# Altium schematic sheet 01-POWER.SchDoc
size A4; SheetNumber: 1; SheetTotal: 3
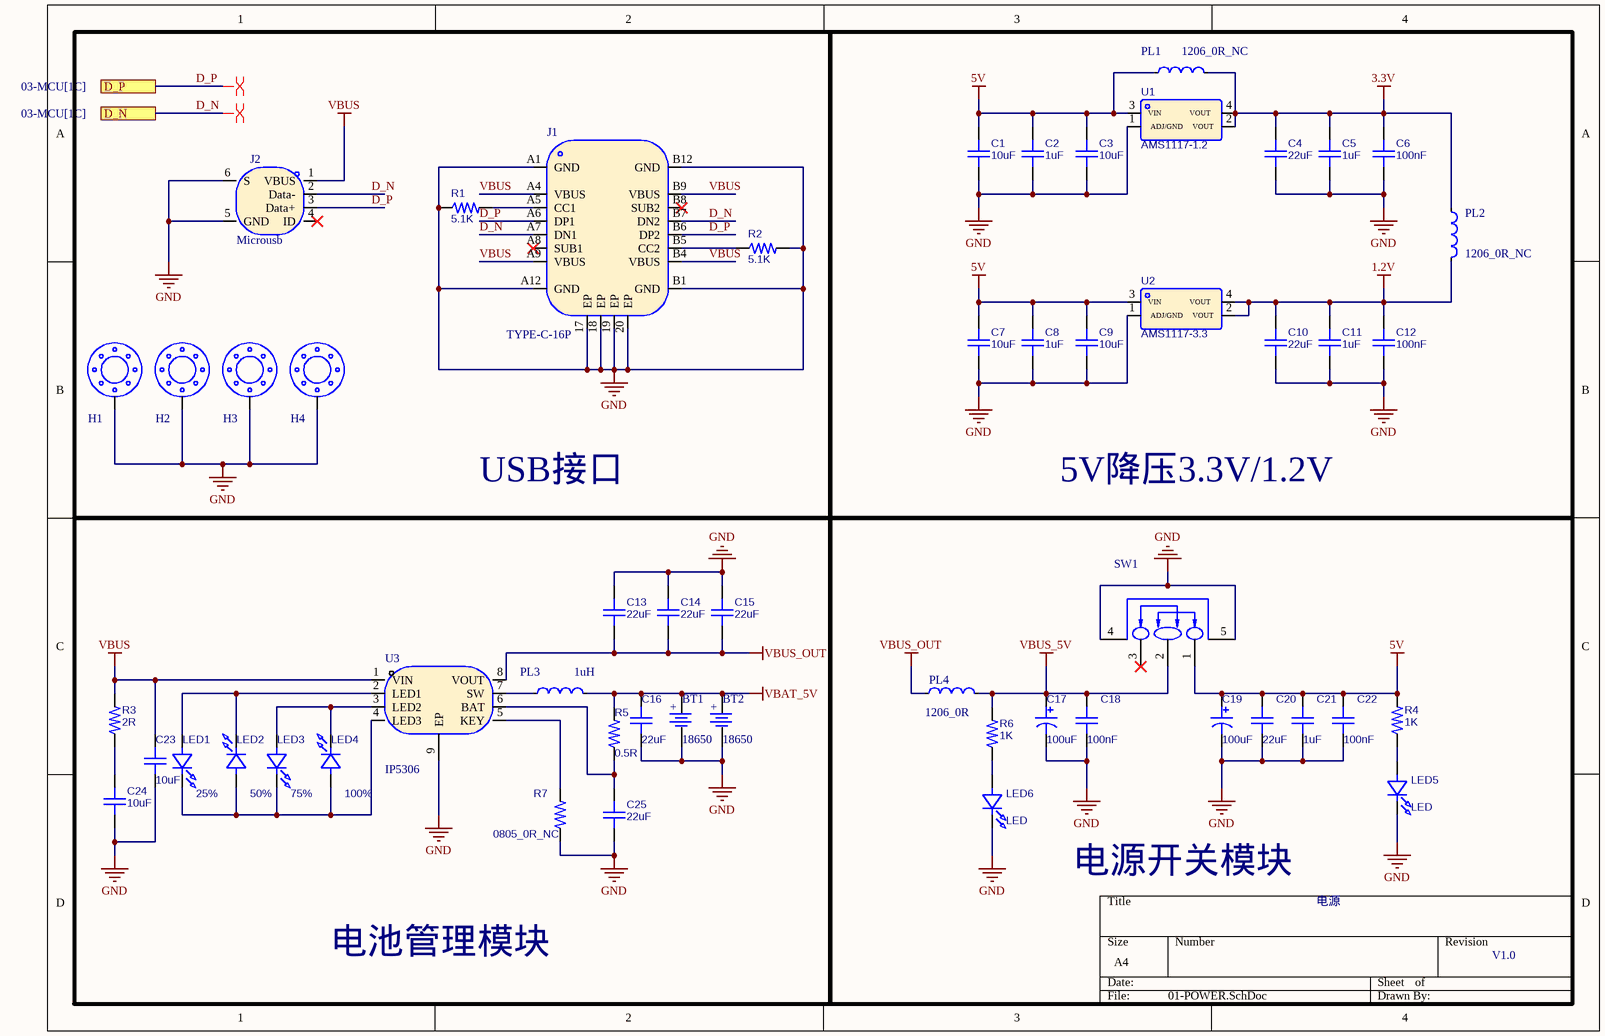
[diagram p0: 01-POWER.SchDoc]

## Parts
BT1  18650  [BAT-SMD-18650]
BT2  18650  [BAT-SMD-18650]
C1  10uF  [CAP-SMD-0603]
C2  1uF  [CAP-SMD-0603]
C3  10uF  [CAP-SMD-0603]
C4  22uF  [CAP-SMD-0603]
C5  1uF  [CAP-SMD-0603]
C6  100nF  [CAP-SMD-0603]
C7  10uF  [CAP-SMD-0603]
C8  1uF  [CAP-SMD-0603]
C9  10uF  [CAP-SMD-0603]
C10  22uF  [CAP-SMD-0603]
C11  1uF  [CAP-SMD-0603]
C12  100nF  [CAP-SMD-0603]
C13  22uF  [CAP-SMD-0603]
C14  22uF  [CAP-SMD-0603]
C15  22uF  [CAP-SMD-0603]
C16  22uF  [CAP-SMD-0603]
C17  100uF  [CAPA-TH-5020-P2.0]
C18  100nF  [CAP-SMD-0603]
C19  100uF  [CAPA-TH-5020-P2.0]
C20  22uF  [CAP-SMD-0603]
C21  1uF  [CAP-SMD-0603]
C22  100nF  [CAP-SMD-0603]
C23  10uF  [CAP-SMD-0603]
C24  10uF  [CAP-SMD-0603]
C25  22uF  [CAP-SMD-0603]
H1  M3  [M3-5030-0.3]  (value not drawn)
H2  M3  [M3-5030-0.3]  (value not drawn)
H3  M3  [M3-5030-0.3]  (value not drawn)
H4  M3  [M3-5030-0.3]  (value not drawn)
J1  TYPE-C-16P  [TYPE-C-SMD-16P]
J2  Microusb  [Microusb-SMD-5P]
LED1  25%  [LED-SMD-0805]
LED2  50%  [LED-SMD-0805]
LED3  75%  [LED-SMD-0805]
LED4  100%  [LED-SMD-0805]
LED5  LED  [LED-SMD-0805]
LED6  LED  [LED-SMD-0805]
PL1  1206_0R_NC  [PL-SMD_4.4X4.2-P3.7]
PL2  1206_0R_NC  [PL-SMD_4.4X4.2-P3.7]
PL3  1uH  [PL-SMD_4.4X4.2-P3.7]
PL4  1206_0R  [PL-SMD_4.4X4.2-P3.7]
R1  5.1K  [RES-SMD-0603]
R2  5.1K  [RES-SMD-0603]
R3  2R  [RES-SMD-0603]
R4  1K  [RES-SMD-0603]
R5  0.5R  [RES-SMD-0603]
R6  1K  [RES-SMD-0603]
R7  0805_0R_NC  [RES-SMD-0603]
SW1  SS-12D11G5  [SW-TH-D-P4.8]  (value not drawn)
U1  AMS1117-1.2  [SOT-223-4-LP5.7-P2.3]
U2  AMS1117-3.3  [SOT-223-4-LP5.7-P2.3]
U3  IP5306  [ESOP-8-LP5.3-P1.27]

## Blocks framed on the sheet
USB接口: H1-H4 J1 J2 R1 R2
5V降压3.3V/1.2V: C1-C12 PL1 PL2 U1 U2
电池管理模块: BT1 BT2 C13-C16 C23-C25 LED1-LED4 PL3 R3 R5 R7 U3
电源开关模块: C17-C22 LED5 LED6 PL4 R4 R6 SW1

## Ports
D_N (see 03-MCU[1C]), D_P (see 03-MCU[1C])

## Nets
1.2V: C10.2 C11.2 C12.2 PL2.2 U2.2(VOUT) U2.4(VOUT)
3.3V: C4.2 C5.2 C6.2 PL1.2 PL2.1 U1.2(VOUT) U1.4(VOUT)
5V: C1.2 C2.2 C3.2 C7.2 C8.2 C9.2 C19.1 C20.2 C21.2 C22.2 PL1.1 R4.2 SW1.1 U1.3(VIN) U2.3(VIN)
GND: BT1.2(+) BT2.2(+) C1.1 C2.1 C3.1 C4.1 C5.1 C6.1 C7.1 C8.1 C9.1 C10.1 C11.1 C12.1 C13.2 C14.2 C15.2 C16.1 C17.2 C18.1 C19.2 C20.1 C21.1 C22.1 C23.1 C24.1 C25.1 H1.1 H2.1 H3.1 H4.1 J1.17(EP) J1.18(EP) J1.19(EP) J1.20(EP) J1.A1(GND) J1.A12(GND) J1.B1(GND) J1.B12(GND) J2.5(GND) J2.6(S) LED5.2(K) LED6.2(K) R1.1 R2.2 R7.1 SW1.4 SW1.5 U1.1(ADJ/GND) U2.1(ADJ/GND) U3.9(EP)
VBAT_5V: BT1.1(-) BT2.1(-) C16.2 PL3.2 R5.2
VBUS: C23.2 J1.A4(VBUS) J1.A9(VBUS) J1.B4(VBUS) J1.B9(VBUS) J2.1(VBUS) R3.2 U3.1(VIN)
VBUS_5V: C17.1 C18.2 PL4.2 R6.2 SW1.2
VBUS_OUT: C13.1 C14.1 C15.1 PL4.1 U3.8(VOUT)
D_N: J1.A7(DN1) J1.B7(DN2) J2.2(Data-) ; port D_N
D_P: J1.A6(DP1) J1.B6(DP2) J2.3(Data+) ; port D_P
NetC24_2: C24.2 R3.1
NetC25_2: C25.2 R5.1 U3.6(BAT)
NetJ1_A5: J1.A5(CC1) R1.2
NetJ1_B5: J1.B5(CC2) R2.1
NetLED1_1: LED1.1(A) LED2.2(K) U3.2(LED1)
NetLED1_2: LED1.2(K) LED2.1(A) LED3.2(K) LED4.1(A) U3.4(LED3)
NetLED3_1: LED3.1(A) LED4.2(K) U3.3(LED2)
NetLED5_1: LED5.1(A) R4.1
NetLED6_1: LED6.1(A) R6.1
NetPL3_1: PL3.1 U3.7(SW)
NetR7_2: R7.2 U3.5(KEY)

Not connected (* = marked no-connect by the designer): J1 A8(SUB1)* B8(SUB2)*; J2 4(ID)*; SW1 3*

## Layout directives
differential pair: D_N, D_P

## Notes on the sheet
- 电源
- V1.0

## Library data of the parts
BT1 BT2 = CR2032: 纽扣电池CR2032-BS-6-1; Manufacturer: Q&J; Add into BOM: yes; Connector Type: 电池底座; Symbol: CR2032-BS-6-1; Device: CR2032-BS-6-1; LCSC Part Name: 电池底座 适用电池:CR2032; Supplier Part: C70377; Manufacturer Part: CR2032-BS-6-1; Supplier Footprint: SMD; JLCPCB Part Class: Extended Part; Datasheet: https://atta.szlcsc.com/upload/public/pdf/source/20160427/1461725216549.pdf; Supplier: LCSC; Convert to PCB: yes; Battery Type: CR2032; Operating Temperature Range: -
C1-C16 C18 C20-C25 = CAP: 贴片电容; BOM_Manufacturer: SAMSUNG; BOM_Manufacturer Part: CL03A104KQ3NNNC; nameAlias: Capacitance; Contributor: LCSC; BOM_Supplier: LCSC; BOM_Supplier Part: C160831; BOM_JLCPCB Part Class: Extended Part; spicePre: C; spiceSymbolName: CL03A104KQ3NNNC
C17 C19 = CAPA: 电解电容; BOM_Manufacturer: ValuePro; BOM_Manufacturer Part: 普通黑色470UF 50V; nameAlias: Capacitance; BOM_Supplier: LCSC; BOM_Supplier Part: C34642; BOM_JLCPCB Part Class: Extended Part; spicePre: C; spiceSymbolName: 470UF 50V
H1-H4 = M3: M3螺丝孔
J1 = TYPE-C-16P: TYPE-C-16pin; Manufacturer: kinghelm(金航标); Symbol: KH-TYPE-C-16P; Add into BOM: yes; Connector Type: Type-C; Gender: 母座; Number of Contacts: 16; Number of Ports: 1; Current Rating - Power (Max): 3A; Device: KH-TYPE-C-16P; LCSC Part Name: Type-C 母座 卧贴; Supplier Part: C709357; Manufacturer Part: KH-TYPE-C-16P; Supplier Footprint: SMD; JLCPCB Part Class: Extended Part; Datasheet: https://atta.szlcsc.com/upload/public/pdf/source/20200911/C709357_AA8DCEB38BB20E3035A7ED7AE7667837.pdf; Supplier: LCSC; Convert to PCB: yes; Standard: -; Mounting Style: 卧贴; Operating Temperature Range: -40~+85
J2 = Microusb-5P: 安卓阶梯型USB接口; Manufacturer: Amphenol; Symbol: 10118194-0001LF; Add into BOM: yes; Connector Type: Micro-B; Gender: 母座; Number of Contacts: 5; Number of Ports: 1; Device: 10118194-0001LF; LCSC Part Name: Micro-B 母座; Supplier Part: C132563; Manufacturer Part: 10118194-0001LF; Supplier Footprint: SMD; JLCPCB Part Class: Extended Part; Datasheet: https://atta.szlcsc.com/upload/public/pdf/source/20210630/C132563_323781699BE9D7BFAD8DF70EA5820798.pdf; Supplier: LCSC; Convert to PCB: yes; Standard: USB 2.0
LED1-LED6 = LED: LED灯,发光二极管; BOM_Manufacturer: yongyu(永裕光电); BOM_Manufacturer Part: SZYY0402B; Contributor: LCSC; BOM_Supplier: LCSC; BOM_Supplier Part: C434447; spicePre: L; spiceSymbolName: SZYY0402B
PL1-PL4 = PL-IND: 电感; Manufacturer: Sunlord(顺络); Symbol: GZ1608D121TF-C12391; Device: GZ1608D121TF; Add into BOM: yes; Impedance @ Frequency: 120Ω@100MHz; Tolerance: ±25%; DC Resistance: 200mΩ; Current Rating: 300mA; Circuits: 1; LCSC Part Name: 120Ω@100MHz ±25%; Supplier Part: C12391; Manufacturer Part: GZ1608D121TF; Supplier Footprint: 0603; JLCPCB Part Class: Extended Part; Datasheet: https://atta.szlcsc.com/upload/public/pdf/source/20210830/355EA7C0FAC5394FC0FE3F17C770C20A.pdf; Supplier: LCSC; Convert to PCB: yes
R1-R7 = RES: 贴片电阻; BOM_Manufacturer: Chengdu Guosheng Tech; BOM_Manufacturer Part: 3362P-1-104; Resistance(Ohms): 100K; nameAlias: Resistance; Contributor: LCSC; BOM_Supplier: LCSC; BOM_Supplier Part: C118966; Resistance (Ohms): 100K; BOM_JLCPCB Part Class: Extended Part; spicePre: R; spiceSymbolName: 3362P-1-104_C118966
SW1 = SW-D-3P: 额定电流(DC)：3A 额定电压(DC)：125V 额定电流(AC)：3A 额定电压(AC)：125V; Manufacturer: XKB Connectivity(中国星坤); Add into BOM: yes; Current Rating (DC): 3A; Voltage Rating (DC): 125V; Circuit: 单刀双掷; Mechanical Life: 10000; Actuator Color: 黑色; Actuator Style: 矩形柱状; Pin Style: PC引脚; Switch Length: 13.5mm; Switch Width: 6.6mm; Switch Height: 6.3mm; Name: SS-12D11G5; Symbol: SS-12D11G5; Device: SS-12D11G5; LCSC Part Name: SS-12D11G5; Supplier Part: C692484; Manufacturer Part: SS-12D11G5; Supplier Footprint: 插件; JLCPCB Part Class: 扩展库; Datasheet: https://atta.szlcsc.com/upload/public/pdf/source/20211009/84F89DEF741E27E9E55DE4039DC07CAD.pdf; Supplier: LCSC; Convert to PCB: yes; Current Rating (AC): 3A; Voltage Rating (AC): 125V; Mounting Style: 弯插; Operating Temperature: -40~+85
U1 = AMS1117-5.0: 稳压器芯片; BOM_Manufacturer: JSMSEMI(杰盛微); Contributor: LCSC; BOM_Supplier: LCSC; BOM_Supplier Part: C2718490; BOM_Manufacturer Part: AMS1117-5.0; BOM_JLCPCB Part Class: Extended Part; spicePre: U; spiceSymbolName: AMS1117-5.0_C2718490
U2 = AMS1117-5.0_1: 稳压器芯片; BOM_Manufacturer: JSMSEMI(杰盛微); Contributor: LCSC; BOM_Supplier: LCSC; BOM_Supplier Part: C2718490; BOM_Manufacturer Part: AMS1117-5.0; BOM_JLCPCB Part Class: Extended Part; spicePre: U; spiceSymbolName: AMS1117-5.0_C2718490
U3 = IP5306: 充电电池的类型:-;电池单元组数:-;最大充电电流:-;充满的电池组电压:-;最大供应电压:-;; Manufacturer: INJOINIC(英集芯); Add into BOM: yes; Name: IP5306; Symbol: IP5306; Device: IP5306; LCSC Part Name: IP5306; Supplier Part: C181692; Manufacturer Part: IP5306; Supplier Footprint: ESOP-8; JLCPCB Part Class: 扩展库; Datasheet: https://atta.szlcsc.com/upload/public/pdf/source/20180920/C181692_842C9BF636DF123BB66E91FC1AD6F13F.pdf; Supplier: LCSC; Convert to PCB: yes; Battery Chemistry: -; Number of Cells: -; Charge Current - Max: -; Battery Pack Voltage: -; Voltage - Supply (Max): -; Interface: -